# EAGLE design Sch_v3 (EAGLE 9.5.2)
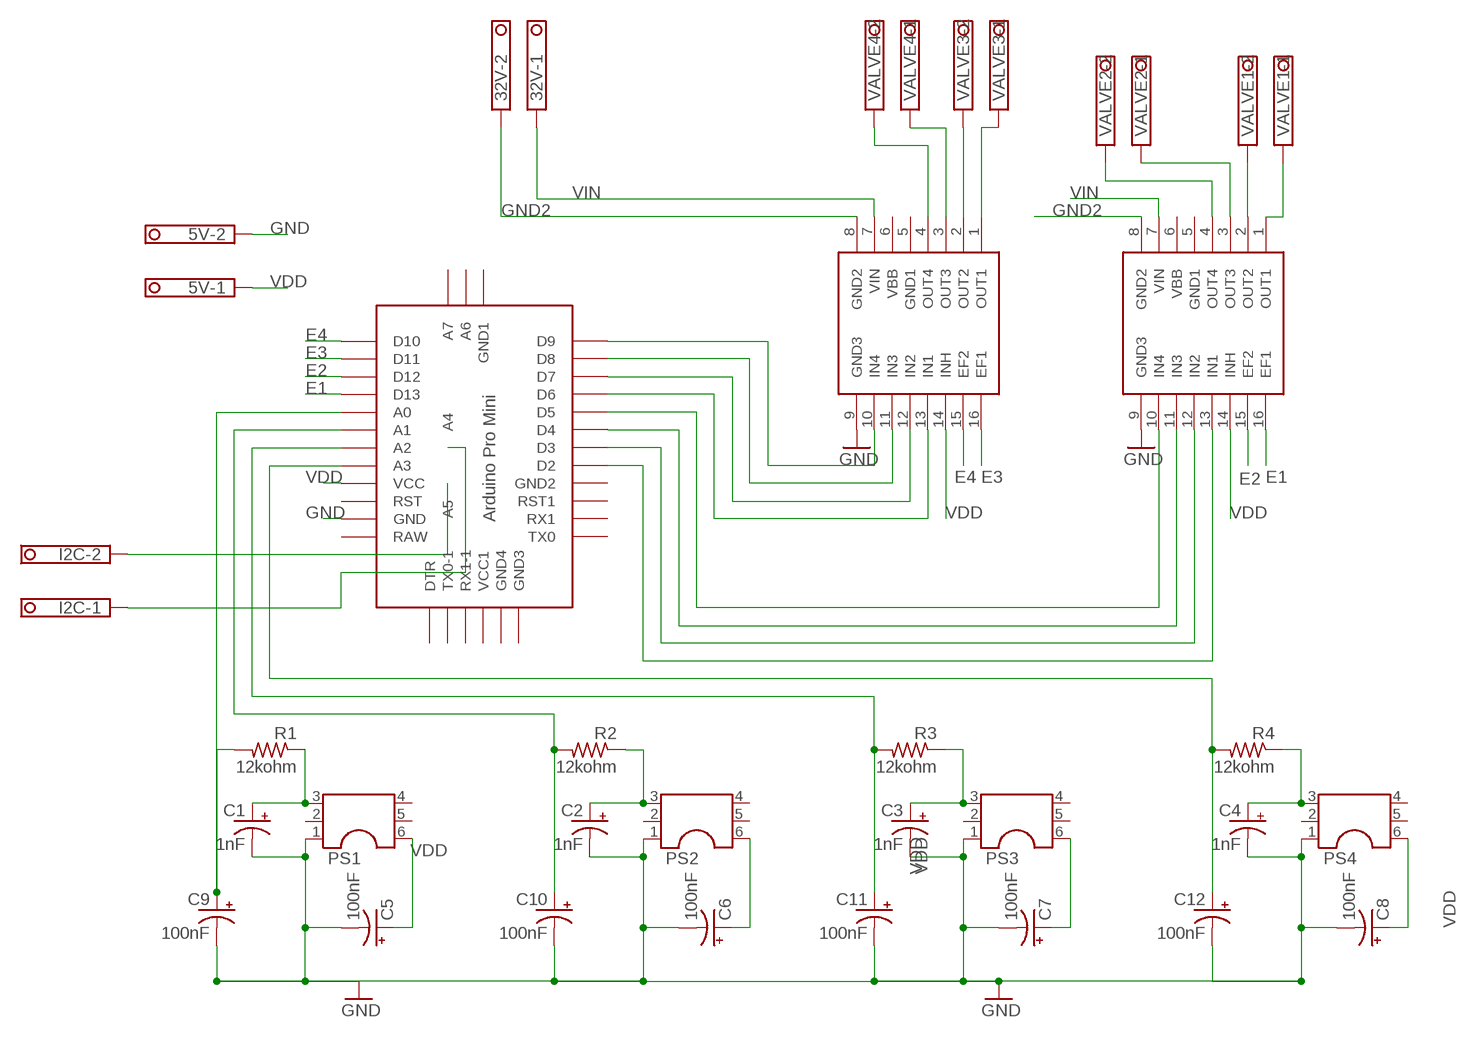
[diagram p0: schematic, sheet 1]

## Parts
5V  1751248  [1751248]
32V  1751248  [1751248]
C1  1nF  CPOL-USE2.5-5  [E2,5-5]
C2  1nF  CPOL-USE2.5-5  [E2,5-5]
C3  1nF  CPOL-USE2.5-5  [E2,5-5]
C4  1nF  CPOL-USE2.5-5  [E2,5-5]
C5  100nF  CPOL-USE2.5-5  [E2,5-5]
C6  100nF  CPOL-USE2.5-5  [E2,5-5]
C7  100nF  CPOL-USE2.5-5  [E2,5-5]
C8  100nF  CPOL-USE2.5-5  [E2,5-5]
C9  100nF  CPOL-USE2.5-5  [E2,5-5]
C10  100nF  CPOL-USE2.5-5  [E2,5-5]
C11  100nF  CPOL-USE2.5-5  [E2,5-5]
C12  100nF  CPOL-USE2.5-5  [E2,5-5]
I2C  1751248  [1751248]
PS1  DIL6  [DIL06]
PS2  DIL6  [DIL06]
PS3  DIL6  [DIL06]
PS4  DIL6  [DIL06]
R1  12kohm  R-US_0204/7  [0204/7]
R2  12kohm  R-US_0204/7  [0204/7]
R3  12kohm  R-US_0204/7  [0204/7]
R4  12kohm  R-US_0204/7  [0204/7]
U$1  ABK-PRO-MINI  [ABK-PRO-MINI]
U$2  A4990  [A4990]
U$3  A4990  [A4990]
VALVE1  1751248  [1751248]
VALVE2  1751248  [1751248]
VALVE3  1751248  [1751248]
VALVE4  1751248  [1751248]

## Nets
E1: U$1.D13 U$3.16(EF1)
E2: U$1.D12 U$3.15(EF2)
E3: U$1.D11 U$2.16(EF1)
E4: U$1.D10 U$2.15(EF2)
GND [GND]: 5V.2 C1.- C2.- C3.- C4.- C5.- C6.- C7.- C8.- C9.- C10.- C11.- C12.- PS1.1 PS2.1 PS3.1 PS4.1 U$1.GND U$2.9(GND3) U$3.9(GND3)
GND2: 32V.2 U$2.8(GND2) U$3.8(GND2)
N$1: C1.+ PS1.3 R1.1
N$2: C2.+ PS2.3 R2.1
N$3: C3.+ PS3.3 R3.1
N$4: C4.+ PS4.3 R4.1
N$5: U$2.2(OUT2) VALVE3.2
N$6: U$2.1(OUT1) VALVE3.1
N$7: U$2.3(OUT3) VALVE4.1
N$8: U$2.4(OUT4) VALVE4.2
N$9: C9.+ R1.2 U$1.A0
N$10: C10.+ R2.2 U$1.A1
N$11: C11.+ R3.2 U$1.A2
N$12: C12.+ R4.2 U$1.A3
N$13: U$3.1(OUT1) VALVE1.1
N$14: U$3.2(OUT2) VALVE1.2
N$15: U$3.3(OUT3) VALVE2.1
N$16: U$3.4(OUT4) VALVE2.2
N$17: U$1.D2 U$3.13(IN1)
N$18: U$1.D3 U$3.12(IN2)
N$19: U$1.D4 U$3.11(IN3)
N$20: U$1.D5 U$3.10(IN4)
N$21: I2C.2 U$1.A5
N$22: I2C.1 U$1.A4
N$23: U$1.D6 U$2.13(IN1)
N$24: U$1.D7 U$2.12(IN2)
N$25: U$1.D8 U$2.11(IN3)
N$26: U$1.D9 U$2.10(IN4)
VDD [Power]: 5V.1 C5.+ C6.+ C7.+ C8.+ PS1.6 PS2.6 PS3.6 PS4.6 U$1.VCC U$2.14(INH) U$3.14(INH)
VIN [Motor Power]: 32V.1 U$2.7(VIN) U$3.7(VIN)
Unconnected: PS1.2 PS1.4 PS1.5 PS2.2 PS2.4 PS2.5 PS3.2 PS3.4 PS3.5 PS4.2 PS4.4 PS4.5 U$1.A6 U$1.A7 U$1.DTR U$1.GND1(GND2) U$1.GND2(GND3) U$1.GND3(GND4) U$1.GND4(GND1) U$1.RAW U$1.RST U$1.RST1 U$1.RX1 U$1.RX1-1 U$1.TX0 U$1.TX0-1 U$1.VCC1 U$2.5(GND1) U$2.6(VBB) U$3.5(GND1) U$3.6(VBB)

## Library data of the parts
5V 32V I2C VALVE1-VALVE4 = con-phoenix-350:1751248: MKDS 1/ 2-3,5 Printklemme Nennstrom: 10 A Bemessungsspannung: 160 V Raster: 3,5 mm Polzahl: 2 Montageart: Löten Anschlussart: Schraubanschluss Anschlussrichtung vom Leiter zur Platine: 0° Source: http://eshop.phoenixcontact.com .. 1751248.pdf; OC_FARNELL: unknown; OC_NEWARK: unknown
C1-C12 = rcl:CPOL-US: POLARIZED CAPACITOR, American symbol; SPICEPREFIX: C
PS1-PS4 = ic-package:DIL6: Dual In Line / Socket
R1-R4 = rcl:R-US_: RESISTOR, American symbol; SPICEPREFIX: R
U$1 = Arduino-clone:ABK-PRO-MINI: ABK Pro-Mini Arduino Clone
U$2 U$3 = pololu-stepper-driver:A4990

## Net classes
1 Power: width 0.305 mm
3 Motor Power: width 0.305 mm, clearance 0.051 mm

## Board
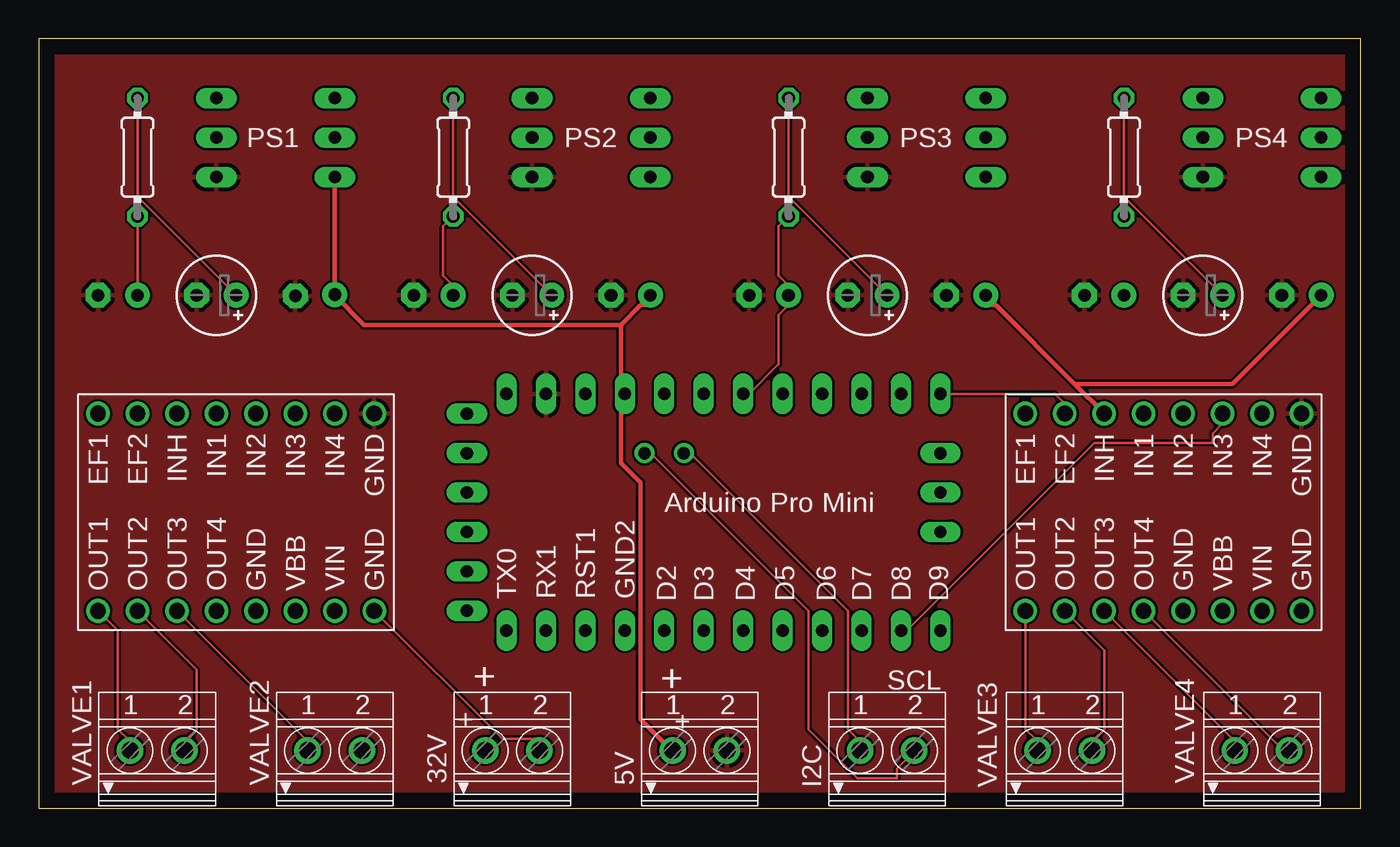
[diagram p1: board, top side]
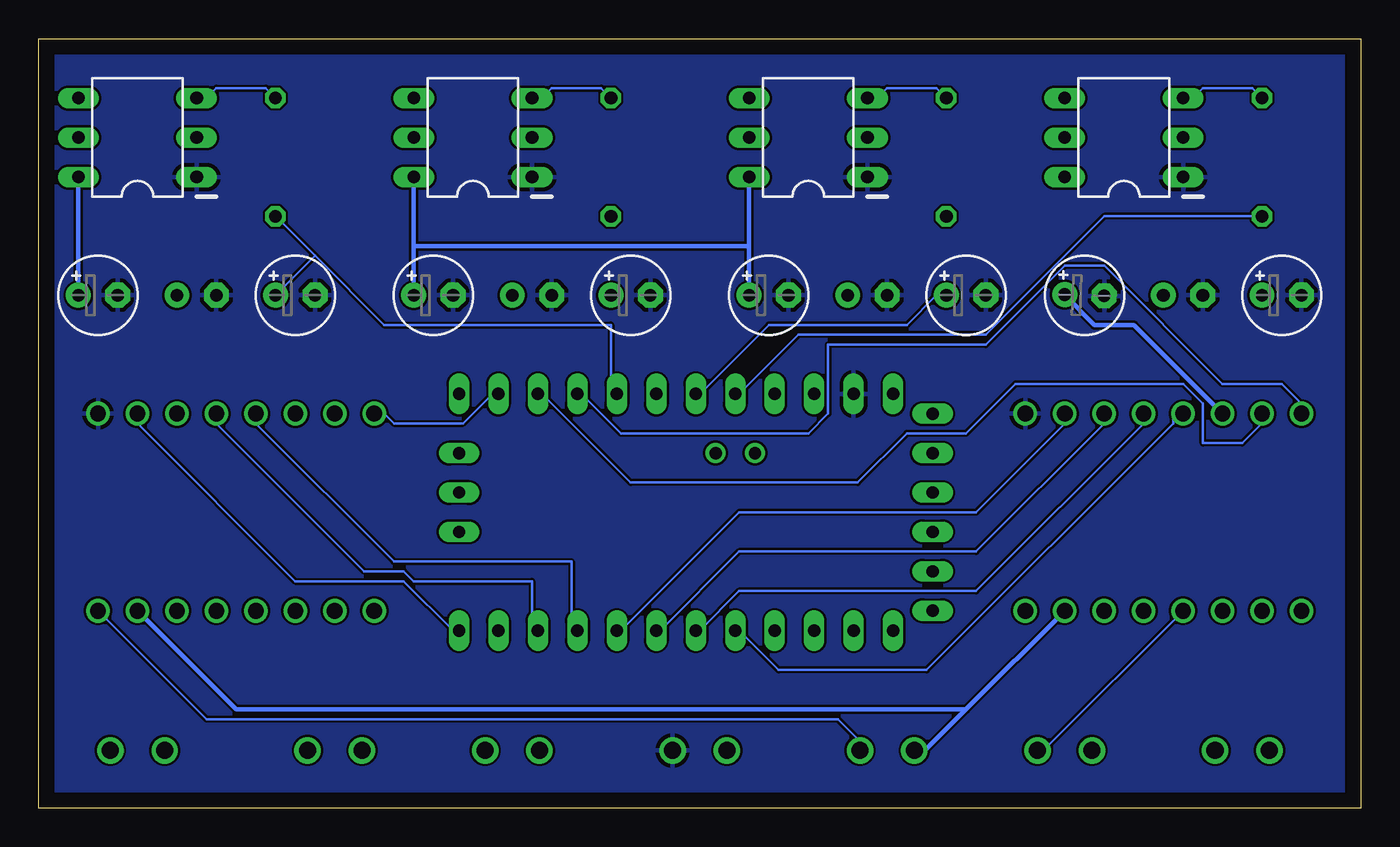
[diagram p2: board, bottom side, seen from below]

Size 85.09 x 49.53 mm. Coordinates in mm from the lower left corner, seen from the top.
Outline: 0,0 85.09,0 85.09,49.53 0,49.53 0,0
Copper layers (1*16): Top 0.035mm / dielectric 1.5mm / Bottom 0.035mm
Design rules "default": minimum track width 6mil, minimum drill 0.35mm, track to track 6mil, track to pad 6mil, pad to pad 6mil, via to via 6mil, smd to smd 6mil, copper to edge 40mil, drill to drill 6mil, minimum pad ring 10mil, minimum via ring 8mil, stop-mask expansion 4mil, vias tented up to drill 0mil, thermal gap 10mil

### Footprints (pad centres in the part's own frame; a part is rotated, then mirrored left to right if it is on the bottom)
1751248 = drill 1.1 pad 1.7: 1 -1.75,-0.1; 2 1.75,-0.1
E2,5-5 = drill 0.813 pad 1.6: + -1.27,0 | drill 0.813 pad 1.6 octagon: - 1.27,0
DIL06 = drill 0.813 long: 1 -2.54,-3.81; 2 0,-3.81; 3 2.54,-3.81; 4 2.54,3.81; 5 0,3.81; 6 -2.54,3.81
0204/7 = drill 0.813 octagon: 1 -3.81,0; 2 3.81,0
ABK-PRO-MINI = drill 0.8 long: A0 10.16,-3.81; A1 10.16,-6.35; A2 10.16,-8.89; A3 10.16,-11.43; A6 3.81,-21.59; A7 6.35,-21.59; D2 -5.08,-3.81; D3 -5.08,-6.35; D4 -5.08,-8.89; D5 -5.08,-11.43; D6 -5.08,-13.97; D7 -5.08,-16.51; D8 -5.08,-19.05; D9 -5.08,-21.59; D10 10.16,-21.59; D11 10.16,-19.05; D12 10.16,-16.51; D13 10.16,-13.97; DTR 8.89,8.89; GND 10.16,3.81; GND1 -5.08,-1.27; GND2 -3.81,8.89; GND3 -1.27,8.89; GND4 1.27,-21.59; RAW 10.16,6.35; RST 10.16,1.27; RST1 -5.08,1.27; RX1 -5.08,3.81; RX1-1 3.81,8.89; TX0 -5.08,6.35; TX0-1 6.35,8.89; VCC 10.16,-1.27; VCC1 1.27,8.89 | drill 0.8: A4 6.35,-5.08; A5 6.35,-2.54
A4990 = drill 1.016: 1 -6.35,8.89; 2 -6.35,6.35; 3 -6.35,3.81; 4 -6.35,1.27; 5 -6.35,-1.27; 6 -6.35,-3.81; 7 -6.35,-6.35; 8 -6.35,-8.89; 9 6.35,-8.89; 10 6.35,-6.35; 11 6.35,-3.81; 12 6.35,-1.27; 13 6.35,1.27; 14 6.35,3.81; 15 6.35,6.35; 16 6.35,8.89

### Placement (x,y rotation side)
5V  42.55,3.81 0 top
32V  30.48,3.81 0 top
C1  11.43,33.02 180 top
C2  31.75,33.02 180 top
C3  53.34,33.02 180 top
C4  74.93,33.02 180 top
C5  17.78,33.02 358.1 bottom
C6  38.1,33.02 0 bottom
C7  59.69,33.02 0 bottom
C8  81.28,33.02 0 bottom
C9  5.08,33.02 0 bottom
C10  25.4,33.02 0 bottom
C11  46.99,33.02 0 bottom
C12  68.58,33.02 0 bottom
I2C  54.61,3.81 0 top
PS1  15.24,43.18 90 bottom
PS2  35.56,43.18 90 bottom
PS3  57.15,43.18 90 bottom
PS4  78.74,43.18 90 bottom
R1  6.35,41.91 270 top
R2  26.67,41.91 270 top
R3  48.26,41.91 270 top
R4  69.85,41.91 270 top
U$1  36.45,16.51 90 top
U$2  72.39,19.05 90 top
U$3  12.7,19.05 90 top
VALVE1  7.62,3.81 0 top
VALVE2  19.05,3.81 0 top
VALVE3  66.04,3.81 0 top
VALVE4  78.74,3.81 0 top

### Tracks (layer width: path | path; a pad name or v marks a point on that pad's centre or on a via)
E1
  Bottom 0.152: U$3.16 3.81,26.04 5.08,27.31 8.89,27.31 16.51,34.93 19.05,34.93 24.13,29.85 34.29,29.85 34.29,25.4 35.56,24.13 47.62,24.13 50.16,26.67 U$1.D13
E2
  Bottom 0.152: U$3.15 6.35,24.77 7.62,23.5 10.16,23.5 10.16,26.04 11.43,27.31 22.22,27.31 25.4,24.13 29.21,24.13 32.38,20.96 46.99,20.96 52.7,26.67 U$1.D12
E3
  Bottom 0.152: U$2.16 62.86,25.4 62.23,24.77 57.78,24.77 55.88,26.67 U$1.D11
E4
  Top 0.152: U$1.D10 65.41,26.67 66.04,26.04 U$2.15
GND
  pour Top: 0,0 85.09,0 85.09,49.53 0,49.53
  pour Bottom: 0,49.53 0,0 85.09,0 85.09,49.53
GND2
  Top 0.152: U$3.8 29.84,4.45 32.38,4.45 32.38,3.81 32V.2
  Bottom 0.152: U$2.8 74.3,5.72 33.66,5.72 31.75,3.81 32V.2
N$1
  Top 0.152: C1.+ 6.35,39.37 R1.1
  Bottom 0.152: R1.1 6.98,46.36 10.16,46.36 10.79,45.72 PS1.3
N$2
  Top 0.152: C2.+ 26.67,39.37 R2.1
  Bottom 0.152: R2.1 27.3,46.36 30.48,46.36 31.11,45.72 PS2.3
N$3
  Top 0.152: C3.+ 48.26,39.37 R3.1
  Bottom 0.152: R3.1 48.89,46.36 52.07,46.36 52.7,45.72 PS3.3
N$4
  Top 0.152: C4.+ 69.85,39.37 R4.1
  Bottom 0.152: R4.1 70.48,46.36 73.66,46.36 74.3,45.72 PS4.3
N$5
  Top 0.152: U$2.2 68.58,10.16 68.58,5.08 67.94,4.45 67.94,3.81 VALVE3.2
N$6
  Top 0.152: U$2.1 63.5,5.08 64.14,4.45 64.14,3.81 VALVE3.1
N$7
  Top 0.152: U$2.3 76.83,4.45 76.83,3.81 VALVE4.1
N$8
  Top 0.152: U$2.4 80.01,3.81 VALVE4.2
N$9
  Top 0.152: R1.2 C9.+
  Bottom 0.152: R1.2 16.51,38.1 24.13,30.48 36.2,30.48 40,26.67 U$1.A0
N$10
  Top 0.152: R2.2 26.04,37.47 26.04,34.29 26.67,33.66 C10.+
  Bottom 0.152: C10.+ 27.3,33.02 29.21,31.12 38.1,31.12 42.55,26.67 U$1.A1
N$11
  Top 0.152: U$1.A2 45.72,26.67 47.62,28.58 47.62,31.75 48.26,32.39 C11.+ 48.26,33.66 47.62,34.29 47.62,37.47 R3.2
N$12
  Bottom 0.152: R4.2 67.31,35.56 | 67.31,35.56 62.86,31.12 48.26,31.12 48.26,26.67 U$1.A3 | 67.31,35.56 C12.+
N$13
  Top 0.152: U$3.1 5.08,11.43 5.08,5.08 5.71,4.45 5.71,3.81 VALVE1.1
N$14
  Top 0.152: U$3.2 10.16,8.89 10.16,5.08 9.52,4.45 9.52,3.81 VALVE1.2
N$15
  Top 0.152: U$3.3 17.14,4.45 17.14,3.81 VALVE2.1
N$16
  Bottom 0.152: U$3.4 20.32,3.81 VALVE2.2
N$17
  Bottom 0.152: U$3.13 12.06,25.4 12.06,24.77 27.94,8.89 37.47,8.89 40,11.43 U$1.D2
N$18
  Bottom 0.152: U$3.12 13.97,24.77 24.77,13.97 40,13.97 42.55,11.43 U$1.D3
N$19
  Bottom 0.152: U$3.11 16.51,24.77 24.77,16.51 40,16.51 45.08,11.43 U$1.D4
N$20
  Bottom 0.152: U$3.10 19.05,24.77 24.77,19.05 40,19.05 47.62,11.43 U$1.D5
N$21
  Top 0.152: U$1.A5 39.37,22.86 49.53,12.7 49.53,5.08 52.7,1.91 55.24,1.91 55.24,2.54 55.88,3.18 I2C.2
N$22
  Top 0.152: U$1.A4 41.91,22.86 52.07,12.7 52.07,5.08 52.7,4.45 52.7,3.81 I2C.1
N$23
  Bottom 0.152: U$2.13 71.12,24.77 62.23,15.88 50.8,15.88 50.8,11.43 U$1.D6
N$24
  Bottom 0.152: U$2.12 73.66,24.77 64.14,15.24 61.59,15.24 60.96,14.61 53.34,14.61 53.34,11.43 U$1.D7
N$25
  Top 0.152: U$2.11 76.2,24.77 75.56,24.13 75.56,23.5 67.94,23.5 55.88,11.43 U$1.D8
N$26
  Bottom 0.152: U$2.10 78.74,24.77 68.58,14.61 61.59,14.61 58.42,11.43 U$1.D9
VDD
  Top 0.305: 66.67,27.31 61.59,32.39 60.96,32.39 C7.+ | 66.67,27.31 U$2.14 | C8.+ 76.83,27.31 66.67,27.31 | PS1.6 19.05,33.66 C5.+ 19.05,33.02 20.95,31.12 37.47,31.12 | 37.47,31.12 37.47,26.67 | 37.47,31.12 38.73,32.39 39.37,32.39 C6.+ | 37.47,26.67 37.47,22.23 38.73,20.96 38.73,5.72 40.64,3.81 5V.1 | 37.47,26.67 U$1.VCC
  Bottom 0.305: C8.+ PS4.6 | C7.+ 60.96,36.2 | 60.96,36.2 PS3.6 | U$3.14 14.6,31.12 17.14,31.12 19.05,33.02 C5.+ | C6.+ 39.37,36.2 | 39.37,36.2 PS2.6 | 39.37,36.2 60.96,36.2
VIN
  Bottom 0.305: 25.4,6.35 27.94,3.81 28.57,3.81 32V.1 | 25.4,6.35 U$3.7 | U$2.7 72.39,6.35 25.4,6.35

### Text on the board
tPlace: Arduino Pro Mini | D2 | D3 | D4 | D5 | D6 | D7 | D8 | D9 | TX0 | RX1 | RST1 | GND2 | + | + | SCL | + | +